# EAGLE design Ex LED.KIT (EAGLE 7.4.0)
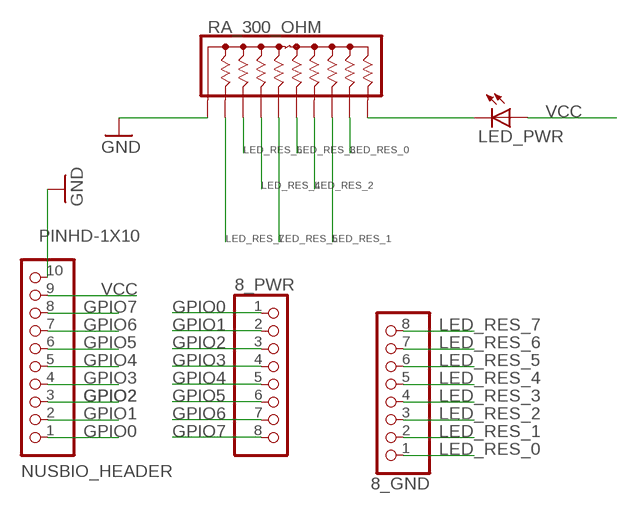
[diagram p0: schematic, sheet 1]

## Parts
8_GND  PINHD-1X8  [1X08]
8_PWR  PINHD-1X8  [1X08]
LED_PWR  LEDCHIPLED_0805  [CHIPLED_0805]
NUSBIO_HEADER  PINHD-1X10  [1X10-BIG]
RA_300_OHM  4610X  [SIP10]

## Nets
GND: NUSBIO_HEADER.10 RA_300_OHM.1
GPIO0: 8_PWR.1 NUSBIO_HEADER.1
GPIO1: 8_PWR.2 NUSBIO_HEADER.2
GPIO2: 8_PWR.3 NUSBIO_HEADER.3
GPIO3: 8_PWR.4 NUSBIO_HEADER.4
GPIO4: 8_PWR.5 NUSBIO_HEADER.5
GPIO5: 8_PWR.6 NUSBIO_HEADER.6
GPIO6: 8_PWR.7 NUSBIO_HEADER.7
GPIO7: 8_PWR.8 NUSBIO_HEADER.8
LED_RES_0: 8_GND.1 RA_300_OHM.9
LED_RES_1: 8_GND.2 RA_300_OHM.8
LED_RES_2: 8_GND.3 RA_300_OHM.7
LED_RES_3: 8_GND.4 RA_300_OHM.6
LED_RES_4: 8_GND.5 RA_300_OHM.4
LED_RES_5: 8_GND.6 RA_300_OHM.5
LED_RES_6: 8_GND.7 RA_300_OHM.3
LED_RES_7: 8_GND.8 RA_300_OHM.2
N$1: LED_PWR.C RA_300_OHM.10
VCC: LED_PWR.A NUSBIO_HEADER.9

## Library data of the parts
8_GND 8_PWR = pinhead:PINHD-1X8: PIN HEADER
LED_PWR = adafruit:LED: LED OSRAM: - CHIPLED LG R971, LG N971, LY N971, LG Q971, LY Q971, LO R971, LY R971 LH N974, LH R974 LS Q976, LO Q976, LY Q976 LO Q996 - Hyper CHIPLED LW Q18S LB Q993, LB Q99A, LB R99A - SideLED LS A670, LO A670, LY A670, LG A670, LP A670 LB A673, LV A673, LT A673, LW A673 LH A674 LY A675 LS A676, LA A676, LO A676, LY A676, LW A676 LS A679, LY A679, LG A679 - Hyper Micro SIDELED® LS Y876, LA Y876, LO Y876, LY Y876 LT Y87S - SmartLED LW L88C, LW L88S LB L89C, LB L89S, LG L890 LS L89K, LO L89K, LY L89K LS L896, LA L896, LO L896, LY L896 - TOPLED LS T670, LO T670, LY T670, LG T670, LP T670 LSG T670, LSP T670, LSY T670, LOP T670, LYG T670 LG T671, LOG T671, LSG T671 LB T673, LV T673, LT T673, LW T673 LH T674 LS T676, LA T676, LO T676, LY T676, LB T676, LH T676, LSB T676, LW T676 LB T67C, LV T67C, LT T67C, LS T67K, LO T67K, LY T67K, LW E67C LS E67B, LA E67B, LO E67B, LY E67B, LB E67C, LV E67C, LT E67C LW T67C LS T679, LY T679, LG T679 LS T770, LO T770, LY T770, LG T770, LP T770 LB T773, LV T773, LT T773, LW T773 LH T774 LS E675, LA E675, LY E675, LS T675 LS T776, LA T776, LO T776, LY T776, LB T776 LHGB T686 LT T68C, LB T68C - Hyper Mini TOPLED® LB M676 - Mini TOPLED Santana® LG M470 LS M47K, LO M47K, LY M47K Source: http://www.osram.convergy.de/
NUSBIO_HEADER = adafruit:PINHD-1X10: Pin header 1x10 0.1" spacing With round pins
RA_300_OHM = resistor-sip:4610X: Bourns 4600X Series - Thick Film Conformal SIPs 4610X-101 Resistor Network Configuration: 101 (Bussed Resistors) Resistance range: 10 ohms to 10 Megaohms Maximum Operating Voltage: 100V Source: http://www.bourns.com/ProductLine.aspx?name=standard_thick_film_networks PDF: http://www.bourns.com/data/global/pdfs/4600X.pdf

## Board
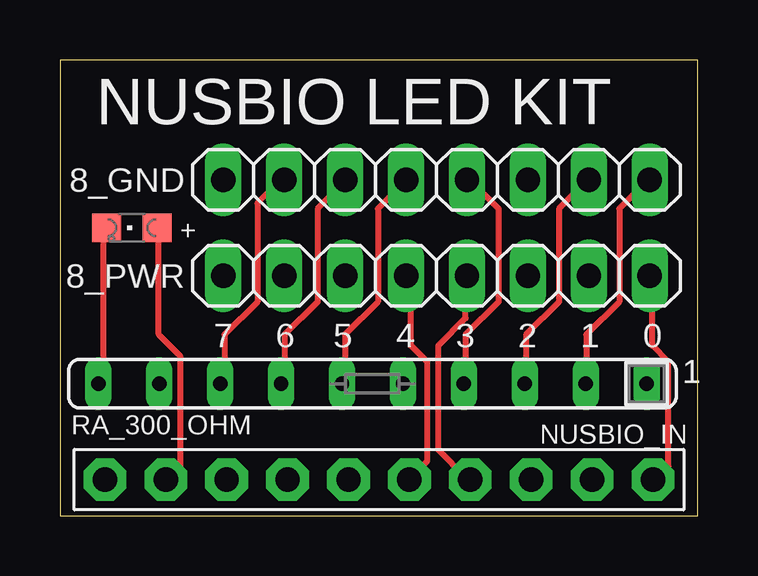
[diagram p1: board, top side]
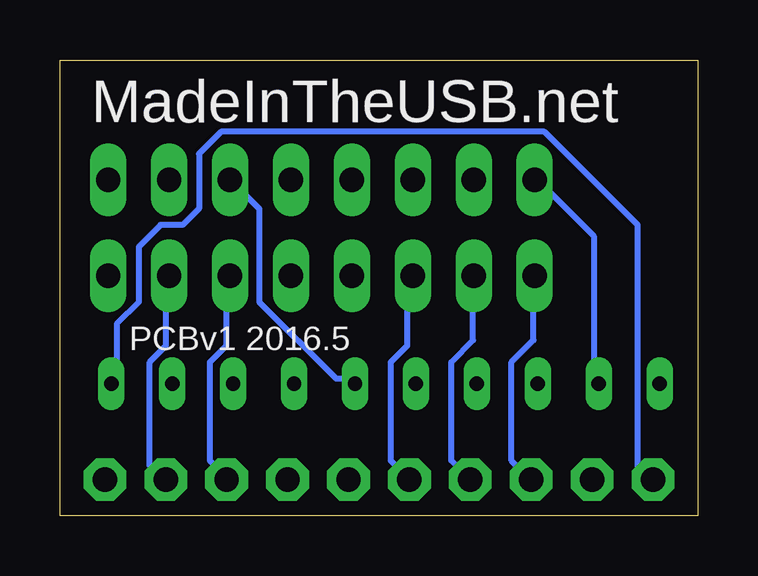
[diagram p2: board, bottom side, seen from below]

Size 26.6 x 19 mm. Coordinates in mm from the lower left corner, seen from the top.
Outline: 0,0 26.6,0 26.6,19 0,19 0,0
Copper layers (1*16): Top 0.035mm / dielectric 1.5mm / Bottom 0.035mm
Design rules "default": minimum track width 10mil, minimum drill 24mil, track to track 8mil, track to pad 8mil, pad to pad 8mil, via to via 8mil, smd to smd 8mil, copper to edge 40mil, drill to drill 8mil, minimum pad ring 10mil, minimum via ring 8mil, stop-mask expansion 4mil, vias tented up to drill 0mil, thermal gap 10mil

### Footprints (pad centres in the part's own frame; a part is rotated, then mirrored left to right if it is on the bottom)
1X08 = drill 1.016 long: 1 -8.89,0; 2 -6.35,0; 3 -3.81,0; 4 -1.27,0; 5 1.27,0; 6 3.81,0; 7 6.35,0; 8 8.89,0
CHIPLED_0805 = smd 1.2 x 1.2: A 0,-1.05; C 0,1.05
1X10-BIG = drill 1.016 pad 1.778 octagon: 1 -11.43,0; 2 -8.89,0; 3 -6.35,0; 4 -3.81,0; 5 -1.27,0; 6 1.27,0; 7 3.81,0; 8 6.35,0; 9 8.89,0; 10 11.43,0
SIP10 = drill 0.6 long: 1 -11.46,0; 2 -8.92,0; 3 -6.38,0; 4 -3.84,0; 5 -1.3,0; 6 1.24,0; 7 3.78,0; 8 6.32,0; 9 8.86,0; 10 11.4,0

### Placement (x,y rotation side)
8_GND  15.7,14 0 top
8_PWR  15.7,10 180 top
LED_PWR  3,12 90 top
NUSBIO_HEADER  13.3,1.5 180 top
RA_300_OHM  13,5.5 180 top

### Tracks (layer width: path | path; a pad name or v marks a point on that pad's centre or on a via)
GND
  Bottom 0.254: RA_300_OHM.1 24.23,5.71 24.23,8 23.32,8.91 23.32,11.2 22.4,12.12 21.49,12.12 20.8,12.8 20.8,15.09 19.89,16 6.4,16 2.52,12.12 2.52,2.06 2.06,1.6 NUSBIO_HEADER.10
GPIO0
  Top 0.254: 8_PWR.1 24.69,9.83 24.69,7.09 25.38,6.4 25.38,2.06 24.92,1.6 NUSBIO_HEADER.1
GPIO1
  Bottom 0.254: 8_PWR.2 22.17,9.83 22.17,7.09 22.86,6.4 22.86,2.06 22.4,1.6 NUSBIO_HEADER.2
GPIO2
  Bottom 0.254: 8_PWR.3 19.66,9.83 19.66,7.09 20.34,6.4 20.34,2.29 19.66,1.6 NUSBIO_HEADER.3
GPIO3
  Top 0.254: 8_PWR.4 16.92,9.83 16.92,8.23 15.77,7.09 15.77,2.74 16.92,1.6 NUSBIO_HEADER.4
GPIO4
  Top 0.254: 8_PWR.5 14.63,9.83 14.63,7.09 15.32,6.4 15.32,2.29 14.63,1.6 NUSBIO_HEADER.5
GPIO5
  Bottom 0.254: 8_PWR.6 12.12,9.83 12.12,7.09 12.8,6.4 12.8,2.29 12.12,1.6 NUSBIO_HEADER.6
GPIO6
  Bottom 0.254: 8_PWR.7 9.37,9.83 9.37,7.32 10.29,6.4 10.29,2.29 9.6,1.6 NUSBIO_HEADER.7
GPIO7
  Bottom 0.254: 8_PWR.8 6.86,9.83 6.86,7.32 7.77,6.4 7.77,2.29 7.09,1.6 NUSBIO_HEADER.8
LED_RES_0
  Bottom 0.254: RA_300_OHM.9 4.34,5.71 4.34,11.66 6.63,13.95 8_GND.1
LED_RES_1
  Top 0.254: RA_300_OHM.8 6.86,5.71 6.86,7.54 8.23,8.91 8.23,13.03 9.14,13.95 8_GND.2
LED_RES_2
  Top 0.254: RA_300_OHM.7 9.37,5.71 9.37,7.54 10.74,8.91 10.74,12.8 11.89,13.95 8_GND.3
LED_RES_3
  Top 0.254: RA_300_OHM.6 11.89,5.71 11.89,7.54 13.26,8.91 13.26,12.8 14.4,13.95 8_GND.4
LED_RES_4
  Top 0.254: RA_300_OHM.4 16.92,5.71 16.92,7.54 18.29,8.91 18.29,12.8 17.14,13.95 8_GND.5
LED_RES_5
  Bottom 0.254: RA_300_OHM.5 14.4,5.71 15.09,5.71 18.29,8.91 18.29,12.8 19.43,13.95 8_GND.6
LED_RES_6
  Top 0.254: RA_300_OHM.3 19.43,5.71 19.43,7.54 20.8,8.91 20.8,12.8 21.95,13.95 8_GND.7
LED_RES_7
  Top 0.254: RA_300_OHM.2 21.95,5.71 21.95,7.54 23.32,8.91 23.32,12.8 24.46,13.95 8_GND.8
N$1
  Top 0.254: LED_PWR.C 1.83,11.89 1.83,5.94 1.6,5.71 RA_300_OHM.10
VCC
  Top 0.254: LED_PWR.A 4.12,11.89 4.12,7.54 5.03,6.63 5.03,2.06 4.57,1.6 NUSBIO_HEADER.9

### Text on the board
tNames: NUSBIO LED KIT | + | 7 | 6 | 5 | 4 | 3 | 2 | 1 | 0 | NUSBIO_IN
bNames: MadeInTheUSB.net | PCBv1 2016.5